# Altium schematic sheet 齐纳安全栅.SchDoc
size A4
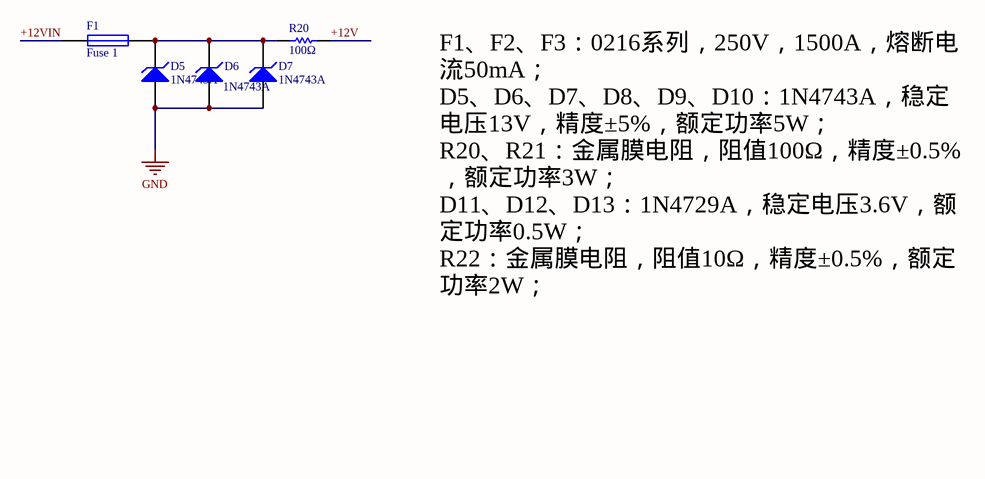
[diagram p0: 齐纳安全栅.SchDoc]

## Parts
D5  1N4743A  [DO-41]
D6  1N4743A  [DO-41]
D7  1N4743A  [DO-41]
F1  Fuse 1  [PIN-W2/E2.8]
R20  100Ω  [AXIAL-0.3]

## Nets
GND: D5.1(A) D6.1(A) D7.1(A)
+12V: R20.2
+12VIN: F1.1
NetD5_2: D5.2(K) D6.2(K) D7.2(K) F1.2 R20.1

## Notes on the sheet
- F1、F2、F3：0216系列，250V，1500A，熔断电流50mA；
  D5、D6、D7、D8、D9、D10：1N4743A，稳定电压13V，精度±5%，额定功率5W；
  R20、R21：金属膜电阻，阻值100Ω，精度±0.5%，额定功率3W；
  D11、D12、D13：1N4729A，稳定电压3.6V，额定功率0.5W；
  R22：金属膜电阻，阻值10Ω，精度±0.5%，额定功率2W；

## Library data of the parts
D5-D7 = D Zener: Zener Diode; Published: 8-Jun-2000; LatestRevisionDate: 17-Jul-2002; LatestRevisionNote: Re-released for DXP Platform.; PackageReference: DIODE-0.7; Publisher: Altium Limited; PackageDescription: Diode, Thru-Hole; 2 Leads; 0.7 in Pin Spacing
F1 = Fuse 1: Fuse; Published: 8-Jun-2000; LatestRevisionDate: 17-Jul-2002; LatestRevisionNote: Re-released for DXP Platform.; PackageReference: PIN-W2/E2.8; Publisher: Altium Limited; PackageDescription: Thru-Hole; 2 Leads
R20 = Res1: Resistor; Value: 100; Published: 8-Jun-2000; LatestRevisionDate: 17-Jul-2002; LatestRevisionNote: Re-released for DXP Platform.; PackageReference: AXIAL-0.3; Publisher: Altium Limited; PackageDescription: Axial Device, Thru-Hole; 2 Leads; 0.3 in Pin Spacing